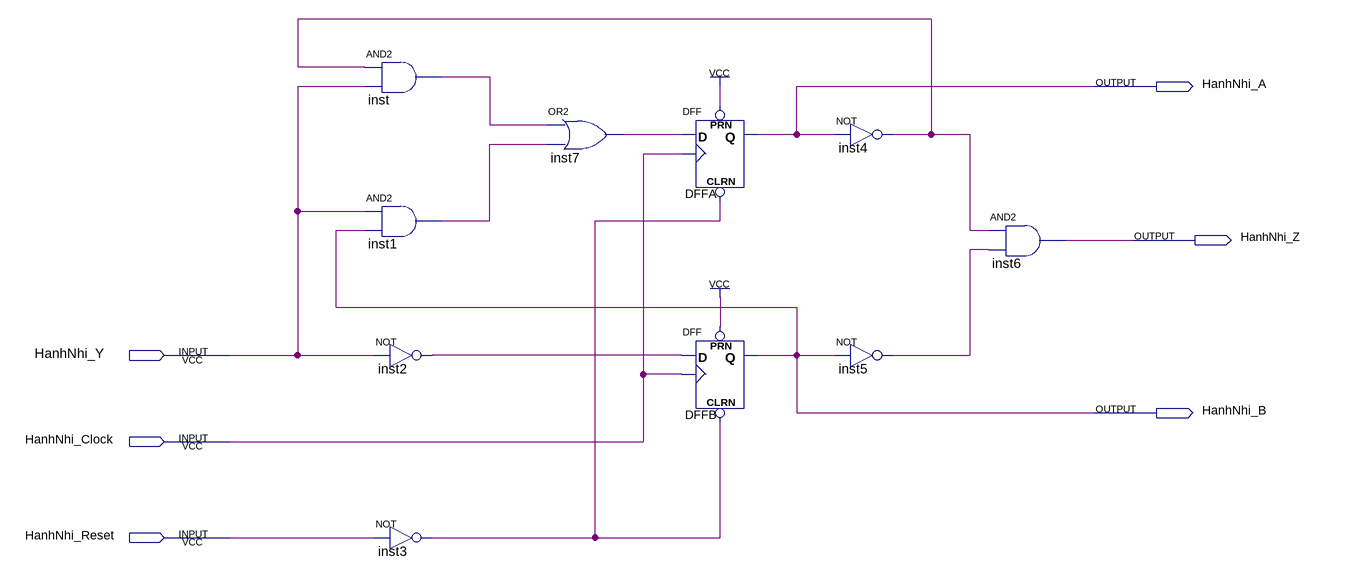
[diagram p0: schematic sheet]
// Quartus schematic Assignment1.bdf as structural Verilog: 10 symbols, 6 pins
module Assignment1 (
  input  HanhNhi_Y,
  input  HanhNhi_Clock,
  input  HanhNhi_Reset,
  output HanhNhi_A,
  output HanhNhi_Z,
  output HanhNhi_B
);

  wire inst1_out, inst2_out, inst3_out, inst4_out, inst5_out, inst7_out, inst_out;

  and inst (inst_out, inst4_out, HanhNhi_Y);
  and inst1 (inst1_out, HanhNhi_Y, HanhNhi_B);
  not inst2 (inst2_out, HanhNhi_Y);
  not inst3 (inst3_out, HanhNhi_Reset);
  or inst7 (inst7_out, inst_out, inst1_out);
  DFF DFFA (.CLRN(inst3_out), .CLK(HanhNhi_Clock), .D(inst7_out), .PRN(1'b1), .Q(HanhNhi_A));
  DFF DFFB (.CLRN(inst3_out), .CLK(HanhNhi_Clock), .D(inst2_out), .PRN(1'b1), .Q(HanhNhi_B));
  not inst4 (inst4_out, HanhNhi_A);
  not inst5 (inst5_out, HanhNhi_B);
  and inst6 (HanhNhi_Z, inst4_out, inst5_out);
endmodule
